# Altium schematic sheet TFT.SchDoc
size A4
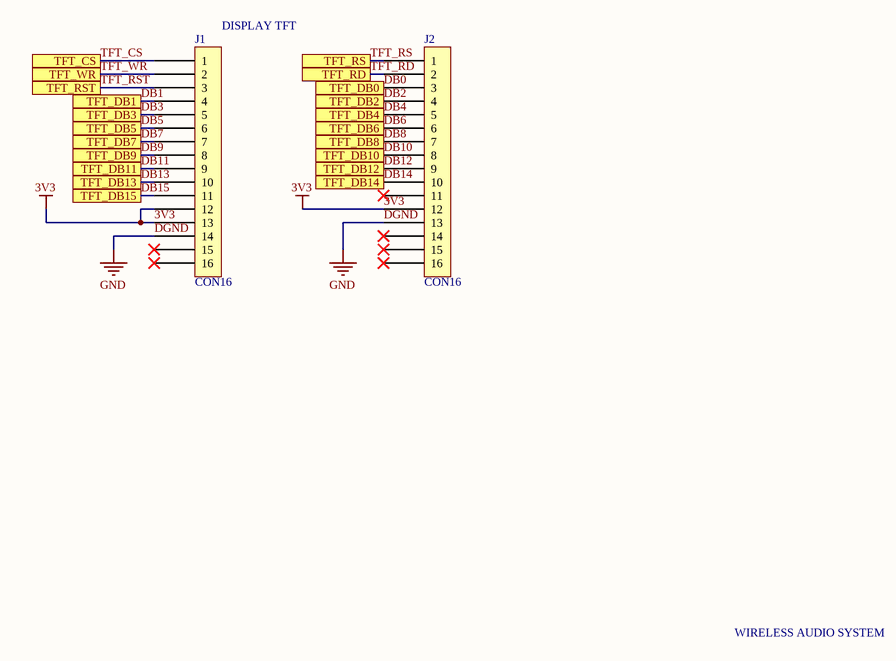
[diagram p0: TFT.SchDoc]

## Parts
J1  CON16  [HDR1X16]
J2  CON16  [HDR1X16]

## Ports
TFT_CS, TFT_DB0, TFT_DB1, TFT_DB2, TFT_DB3, TFT_DB4, TFT_DB5, TFT_DB6, TFT_DB7, TFT_DB8, TFT_DB9, TFT_DB10, TFT_DB11, TFT_DB12, TFT_DB13, TFT_DB14, TFT_DB15, TFT_RD, TFT_RS, TFT_RST, TFT_WR

## Nets
3V3: J1.12 J1.13 J2.12
DGND: J1.14 J2.13  [also labelled GND]
DB0: J2.3 ; port TFT_DB0
DB1: J1.4 ; port TFT_DB1
DB2: J2.4 ; port TFT_DB2
DB3: J1.5 ; port TFT_DB3
DB4: J2.5 ; port TFT_DB4
DB5: J1.6 ; port TFT_DB5
DB6: J2.6 ; port TFT_DB6
DB7: J1.7 ; port TFT_DB7
DB8: J2.7 ; port TFT_DB8
DB9: J1.8 ; port TFT_DB9
DB10: J2.8 ; port TFT_DB10
DB11: J1.9 ; port TFT_DB11
DB12: J2.9 ; port TFT_DB12
DB13: J1.10 ; port TFT_DB13
DB14: J2.10 ; port TFT_DB14
DB15: J1.11 ; port TFT_DB15
TFT_CS: J1.1 ; port TFT_CS
TFT_RD: J2.2 ; port TFT_RD
TFT_RS: J2.1 ; port TFT_RS
TFT_RST: J1.3 ; port TFT_RST
TFT_WR: J1.2 ; port TFT_WR

Not connected (* = marked no-connect by the designer): J1 15* 16*; J2 11* 14* 15* 16*

## Notes on the sheet
- (near J1) DISPLAY TFT
- WIRELESS AUDIO SYSTEM